# EAGLE design CNC-CTRL-BRD-Simple (EAGLE 6.4)
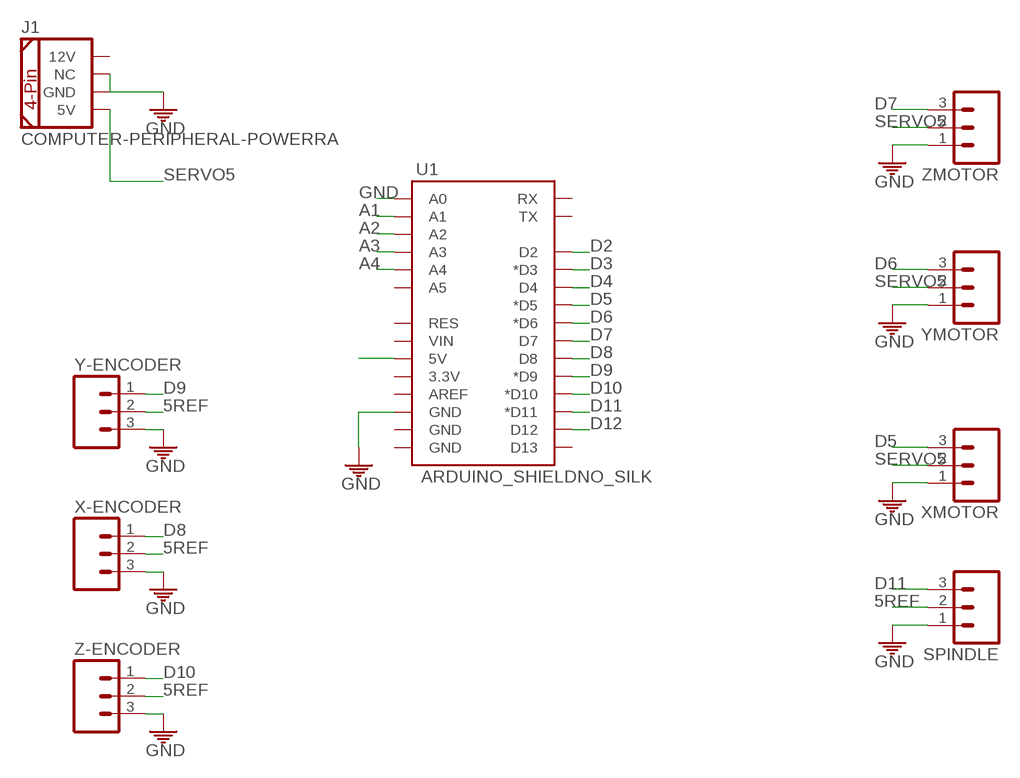
[diagram p0: schematic, sheet 1]

## Parts
J1  COMPUTER-PERIPHERAL-POWERRA  [COMPUTER-PERIPHERAL-POWER-RA]
SPINDLE  M03LOCK  [1X03_LOCK]
U1  ARDUINO_SHIELDNO_SILK  [DUEMILANOVE_VIAS]
X-ENCODER  M03LOCK  [1X03_LOCK]
XMOTOR  M03LOCK  [1X03_LOCK]
Y-ENCODER  M03LOCK  [1X03_LOCK]
YMOTOR  M03LOCK  [1X03_LOCK]
Z-ENCODER  M03LOCK  [1X03_LOCK]
ZMOTOR  M03LOCK  [1X03_LOCK]

## Nets
5REF: SPINDLE.2 U1.5V X-ENCODER.2 Y-ENCODER.2 Z-ENCODER.2
A1: U1.A1
A2: U1.A2
A3: U1.A3
A4: U1.A4
D2: U1.D2
D3: U1.D3(*D3)
D4: U1.D4
D5: U1.D5(*D5) XMOTOR.3
D6: U1.D6(*D6) YMOTOR.3
D7: U1.D7 ZMOTOR.3
D8: U1.D8 X-ENCODER.1
D9: U1.D9(*D9) Y-ENCODER.1
D10: U1.D10(*D10) Z-ENCODER.1
D11: SPINDLE.3 U1.D11(*D11)
D12: U1.D12
GND: J1.GND J1.NC SPINDLE.1 U1.A0 U1.GND@2(GND) X-ENCODER.3 XMOTOR.1 Y-ENCODER.3 YMOTOR.1 Z-ENCODER.3 ZMOTOR.1
SERVO5: J1.5V XMOTOR.2 YMOTOR.2 ZMOTOR.2
Unconnected: J1.12V U1.3.3V U1.A5 U1.AREF U1.D13 U1.GND@0(GND) U1.GND@1(GND) U1.RES U1.RX U1.TX U1.VIN

## Library data of the parts
J1 = SparkFun-Connectors:COMPUTER-PERIPHERAL-POWER
SPINDLE X-ENCODER XMOTOR Y-ENCODER YMOTOR Z-ENCODER ZMOTOR = CMPE118lib:M03: Header 3 Standard 3-pin 0.1" header. Use with straight break away headers (SKU : PRT-00116), right angle break away headers (PRT-00553), swiss pins (PRT-00743), machine pins (PRT-00117), and female headers (PRT-00115). Molex polarized connector foot print use with SKU : PRT-08232 with associated crimp pins and housings.
U1 = SparkFun-Boards:ARDUINO_SHIELD: Arduino shield footprint

## Net classes
0 default: width 0.254 mm

## Board
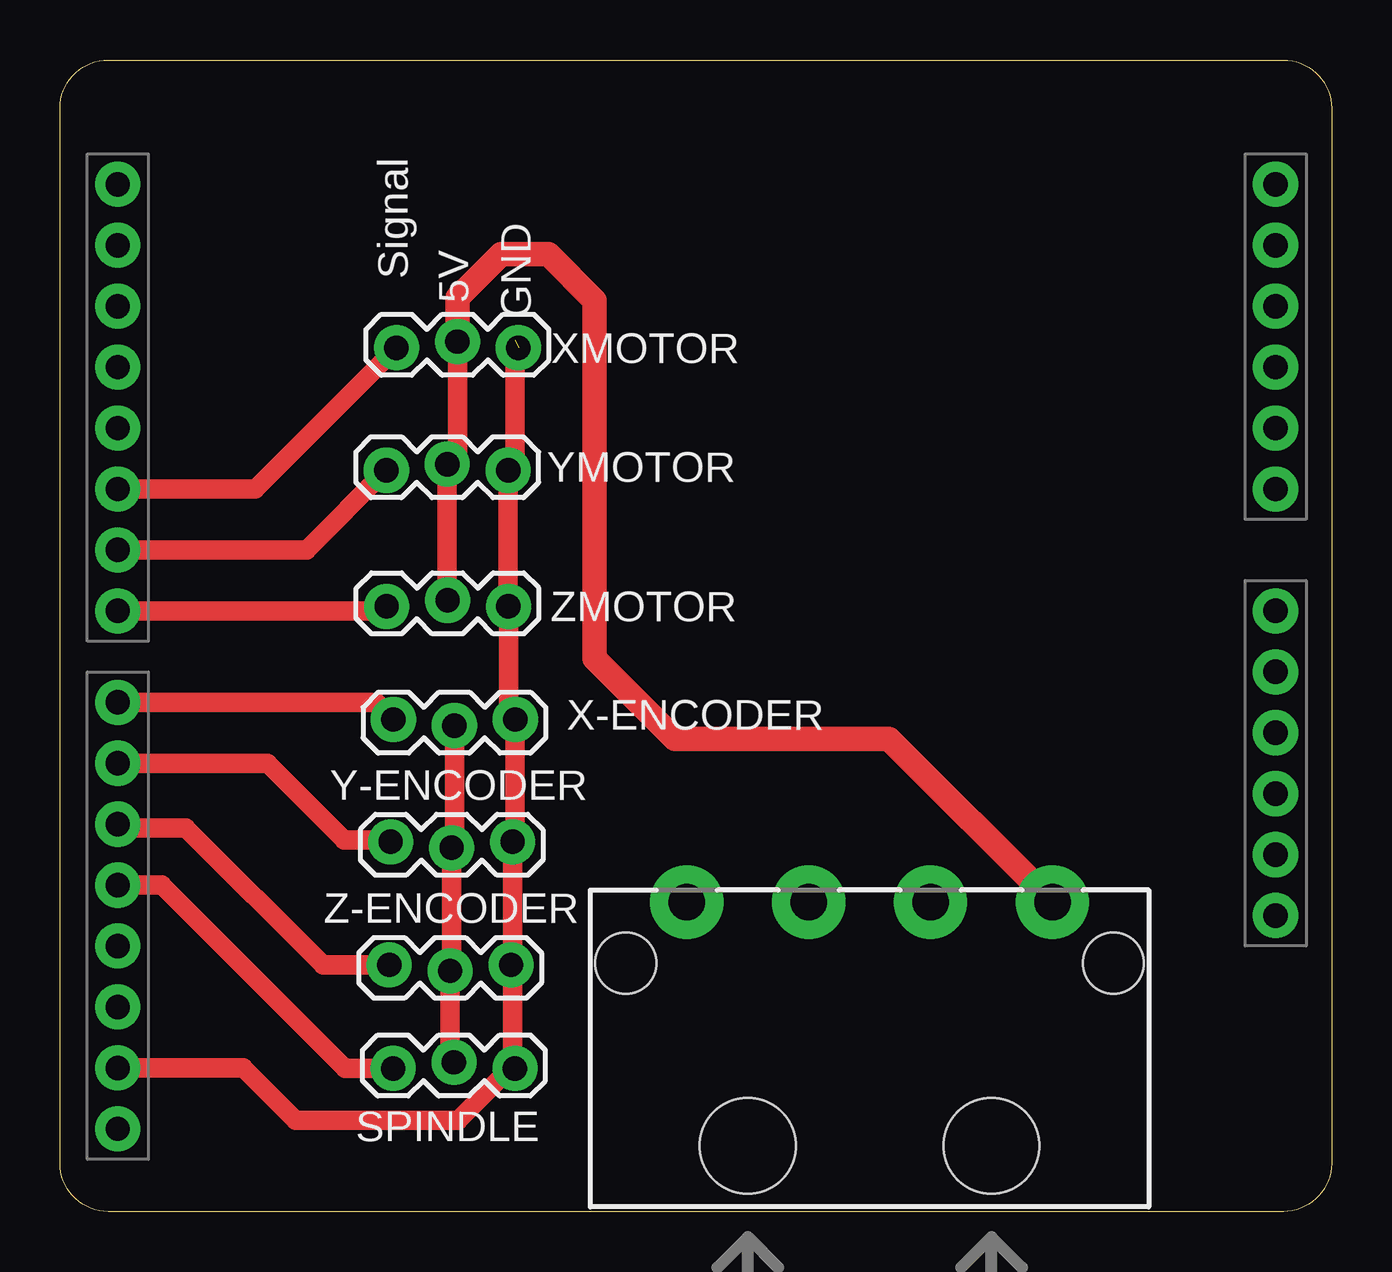
[diagram p1: board, top side]
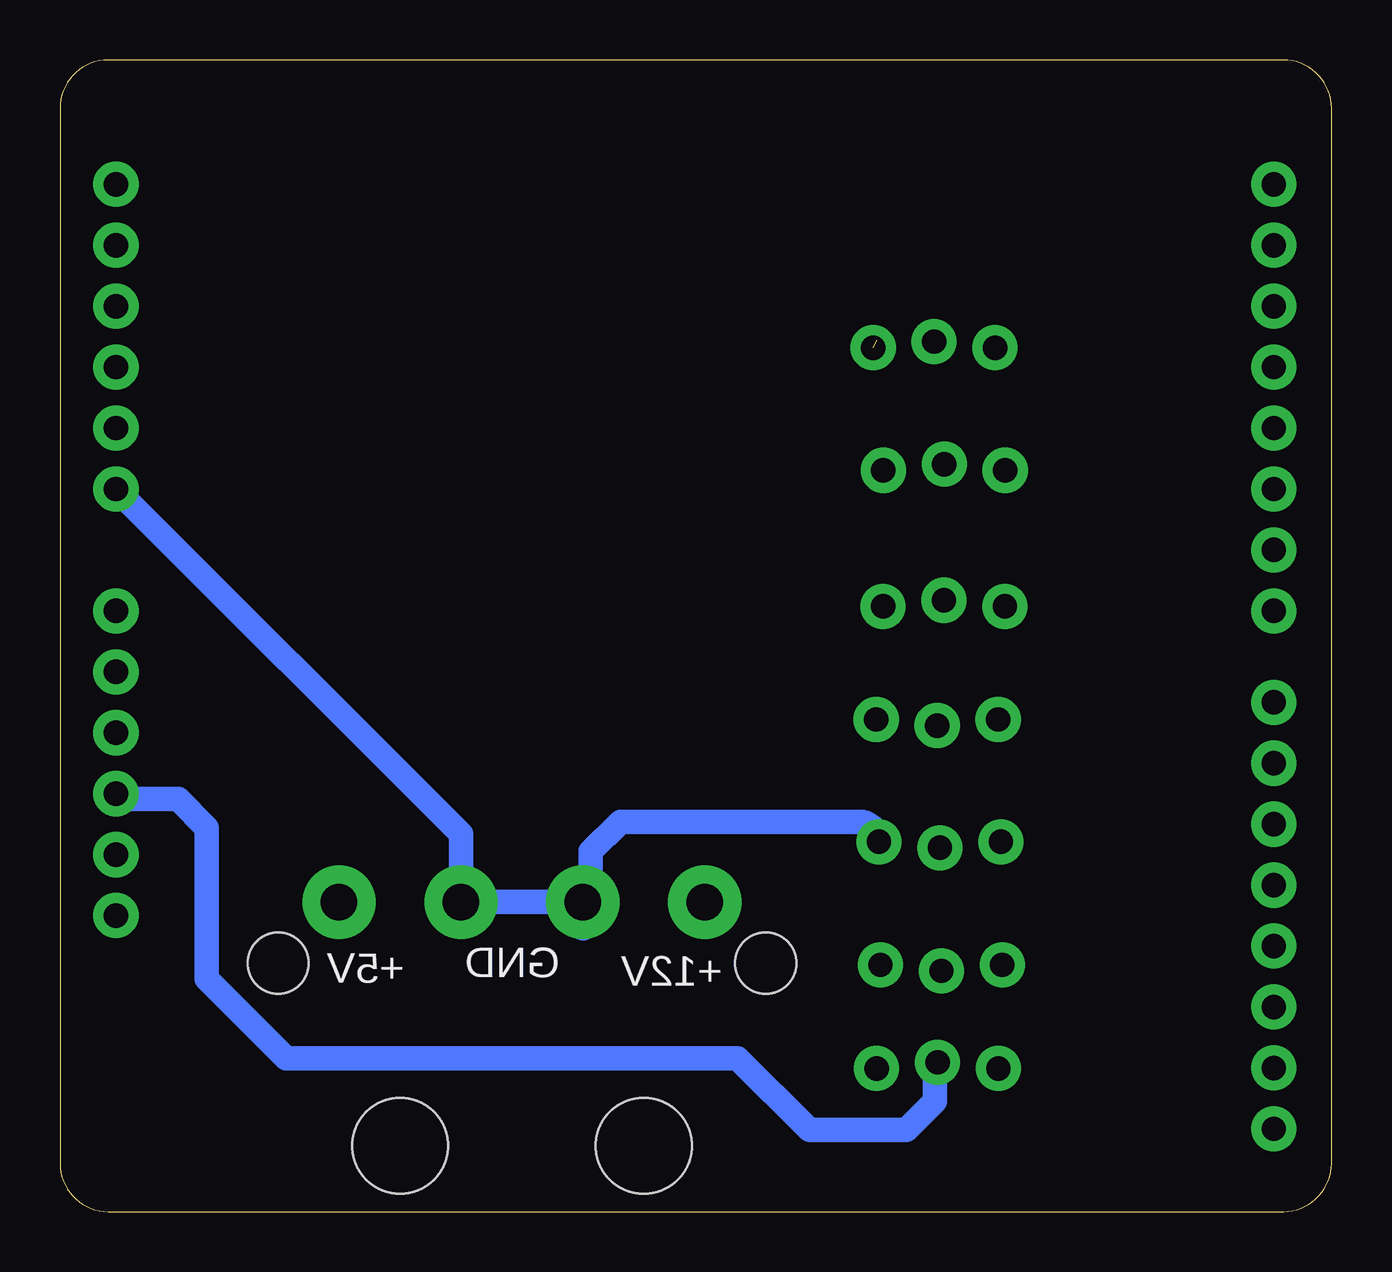
[diagram p2: board, bottom side, seen from below]

Size 53 x 48 mm. Coordinates in mm from the lower left corner, seen from the top.
Outline: 53,46 53,2 arc-90 51,0 2,0 arc-90 0,2 0,46 arc-90 2,48 51,48 arc-90 53,46
Copper layers (1*16): Top 0.035mm / dielectric 1.5mm / Bottom 0.035mm
Design rules "default": minimum track width 10mil, minimum drill 24mil, track to track 8mil, track to pad 8mil, pad to pad 8mil, via to via 8mil, smd to smd 8mil, copper to edge 40mil, drill to drill 8mil, minimum pad ring 10mil, minimum via ring 8mil, stop-mask expansion 4mil, vias tented up to drill 0mil, thermal gap 10mil

### Footprints (pad centres in the part's own frame; a part is rotated, then mirrored left to right if it is on the bottom)
COMPUTER-PERIPHERAL-POWER-RA = drill 1.524 pad 3.048: 5V -7.62,-2.54; 12V 7.62,-2.54; GND -2.54,-2.54; NC 2.54,-2.54 | hole 2.54: -10.16,0; 10.16,0 | hole 3.988: -5.08,7.62; 5.08,7.62
1X03_LOCK = drill 1.016 pad 1.88: 1 0,0.127; 2 2.54,-0.127; 3 5.08,0.127
DUEMILANOVE_VIAS = drill 1.016 pad 1.88: 3.3V 50.8,13.97; 5V 50.8,16.51; A0 50.8,29.21; A1 50.8,31.75; A2 50.8,34.29; A3 50.8,36.83; A4 50.8,39.37; A5 50.8,41.91; AREF 2.54,2.54; D2 2.54,36.83; D3 2.54,34.29; D4 2.54,31.75; D5 2.54,29.21; D6 2.54,26.67; D7 2.54,24.13; D8 2.54,20.32; D9 2.54,17.78; D10 2.54,15.24; D11 2.54,12.7; D12 2.54,10.16; D13 2.54,7.62; GND@0 50.8,19.05; GND@1 50.8,21.59; GND@2 2.54,5.08; RES 50.8,11.43; RX 2.54,41.91; TX 2.54,39.37; VIN 50.8,24.13

### Placement (x,y rotation side)
J1  33.75,10.36 180 top
SPINDLE  18.96,6.09 180 top
U1  -0.13,0.91 0 top
X-ENCODER  13.9,20.38 0 top
XMOTOR  19.11,36.13 180 top
Y-ENCODER  13.78,15.29 0 top
YMOTOR  18.68,31.02 180 top
Z-ENCODER  13.72,10.16 0 top
ZMOTOR  18.69,25.35 180 top

### Tracks (layer width: path | path; a pad name or v marks a point on that pad's centre or on a via)
5REF
  Top 0.813: X-ENCODER.2 16.44,15.27 Y-ENCODER.2 16.32,10.09 Z-ENCODER.2 16.26,6.22 SPINDLE.2
  Bottom 1.016: U1.5V 50.44,17.19 48.07,17.19 46.88,16 46.88,9.7 43.58,6.4 24.76,6.4 21.76,3.4 17.72,3.4 16.53,4.59 16.53,6.12 SPINDLE.2
D5
  Top 0.813: XMOTOR.3 8.14,30.12 U1.D5
D6
  Top 0.813: U1.D6 10.28,27.58 YMOTOR.3
D7
  Top 0.813: ZMOTOR.3 13.42,25.04 U1.D7
D8
  Top 0.813: X-ENCODER.1 13.18,21.23 U1.D8
D9
  Top 0.813: U1.D9 8.65,18.69 11.85,15.49 13.71,15.49 Y-ENCODER.1
D10
  Top 0.813: Z-ENCODER.1 10.96,10.28 5.25,16 2.56,16 U1.D10
D11
  Top 0.813: SPINDLE.3 11.88,5.96 4.23,13.61 U1.D11
GND  (1 unrouted)
  Top 0.813: Z-ENCODER.3 18.86,10.34 | 18.86,10.34 Y-ENCODER.3 18.98,15.53 X-ENCODER.3 18.69,20.79 ZMOTOR.1 YMOTOR.1 18.96,31.18 18.96,36.32 | SPINDLE.1 18.86,6.06 | 18.86,6.06 18.86,10.34 | 18.86,6.06 16.6,3.8 9.82,3.8 7.64,5.99 U1.GND@2
  Bottom 1.016: 18.99,5.99 SPINDLE.1 | U1.A0 36.29,15.74 J1.GND J1.NC 31.21,11.81 30.88,12.14 30.88,15.01 29.63,16.25 19.7,16.25 arc90 Y-ENCODER.3
SERVO5
  Top 0.813: ZMOTOR.2 16.42,25.21 16.42,25.14 16.14,25.42 YMOTOR.2 16.57,31.58 XMOTOR.2
  Top 1.016: 16.57,36.97 XMOTOR.2 16.57,38.08 18.38,39.9 20.36,39.9 22.29,37.97 22.29,23.06 25.64,19.7 34.56,19.7 J1.5V

### Text on the board
bPlace: GND | +5V | +12V
tNames: Signal | GND | 5V